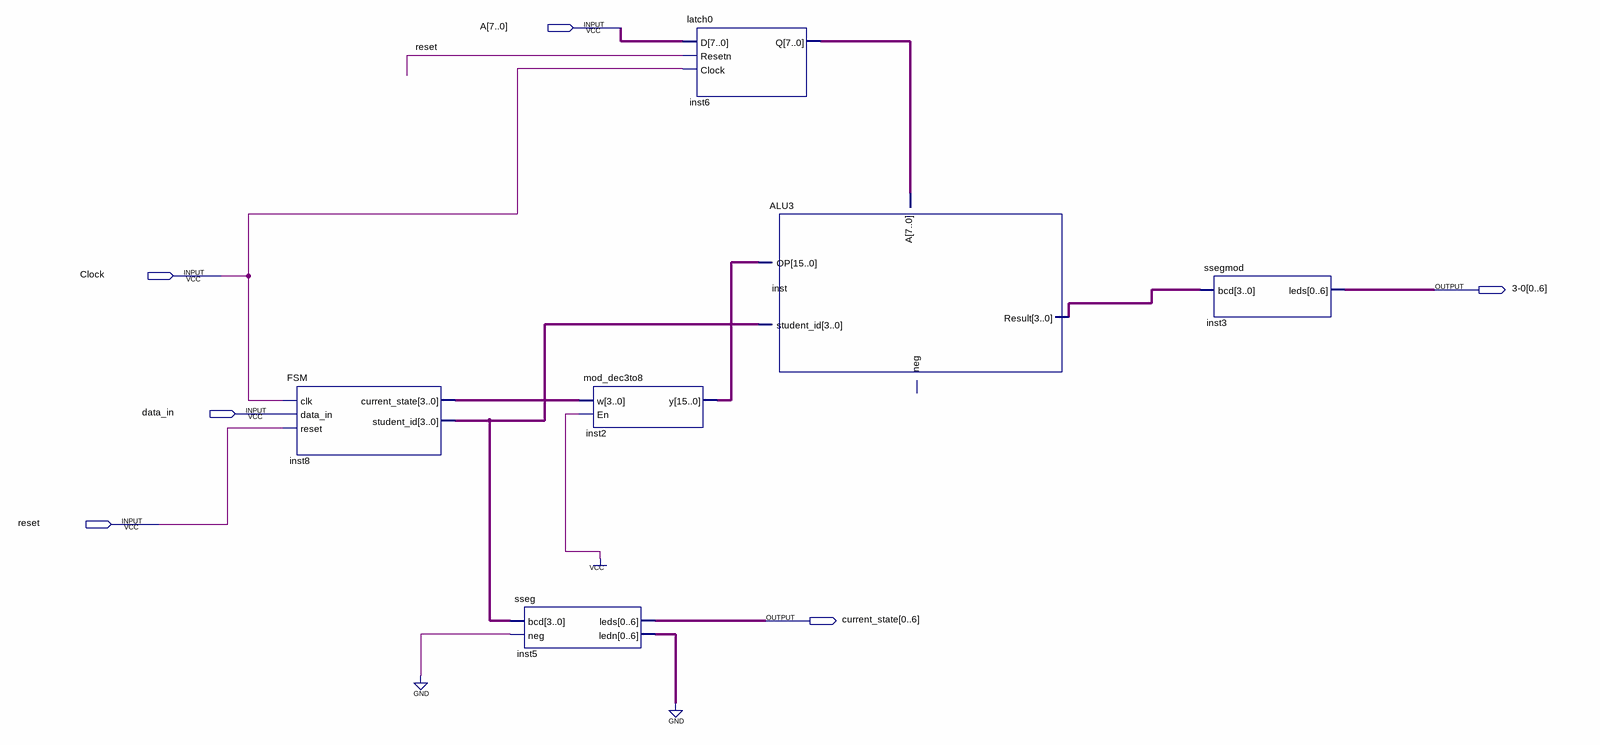
[diagram p0: schematic sheet]
// Quartus schematic prob3.bdf as structural Verilog: 6 symbols, 6 pins
module prob3 (
  input  [7:0] A,
  input  Clock,
  input  data_in,
  input  reset,
  output [0:6] \3-0 ,
  output [0:6] current_state
);

  wire [3:0] inst8_current_state, inst8_student_id, inst_result;
  wire [6:0] inst5_ledn;
  wire [7:0] inst6_q;
  wire [15:0] inst2_y;

  FSM inst8 (
    .clk(Clock), .data_in(data_in), .reset(reset), .student_id(inst8_student_id),
    .current_state(inst8_current_state));
  sseg inst5 (.bcd(inst8_student_id), .neg(1'b0), .leds(current_state), .ledn(inst5_ledn));
  mod_dec3to8 inst2 (.w(inst8_current_state), .En(1'b1), .y(inst2_y));
  latch0 inst6 (.D(A), .Resetn(reset), .Clock(Clock), .Q(inst6_q));
  ALU3 inst (.A(inst6_q), .OP(inst2_y), .student_id(inst8_student_id), .Result(inst_result));  // open: neg
  ssegmod inst3 (.bcd(inst_result), .leds(\3-0 ));
  // also tied to GND on the sheet: {inst5_ledn[0], inst5_ledn[1], inst5_ledn[2], inst5_ledn[3], inst5_ledn[4], inst5_ledn[5], inst5_ledn[6]}
endmodule
